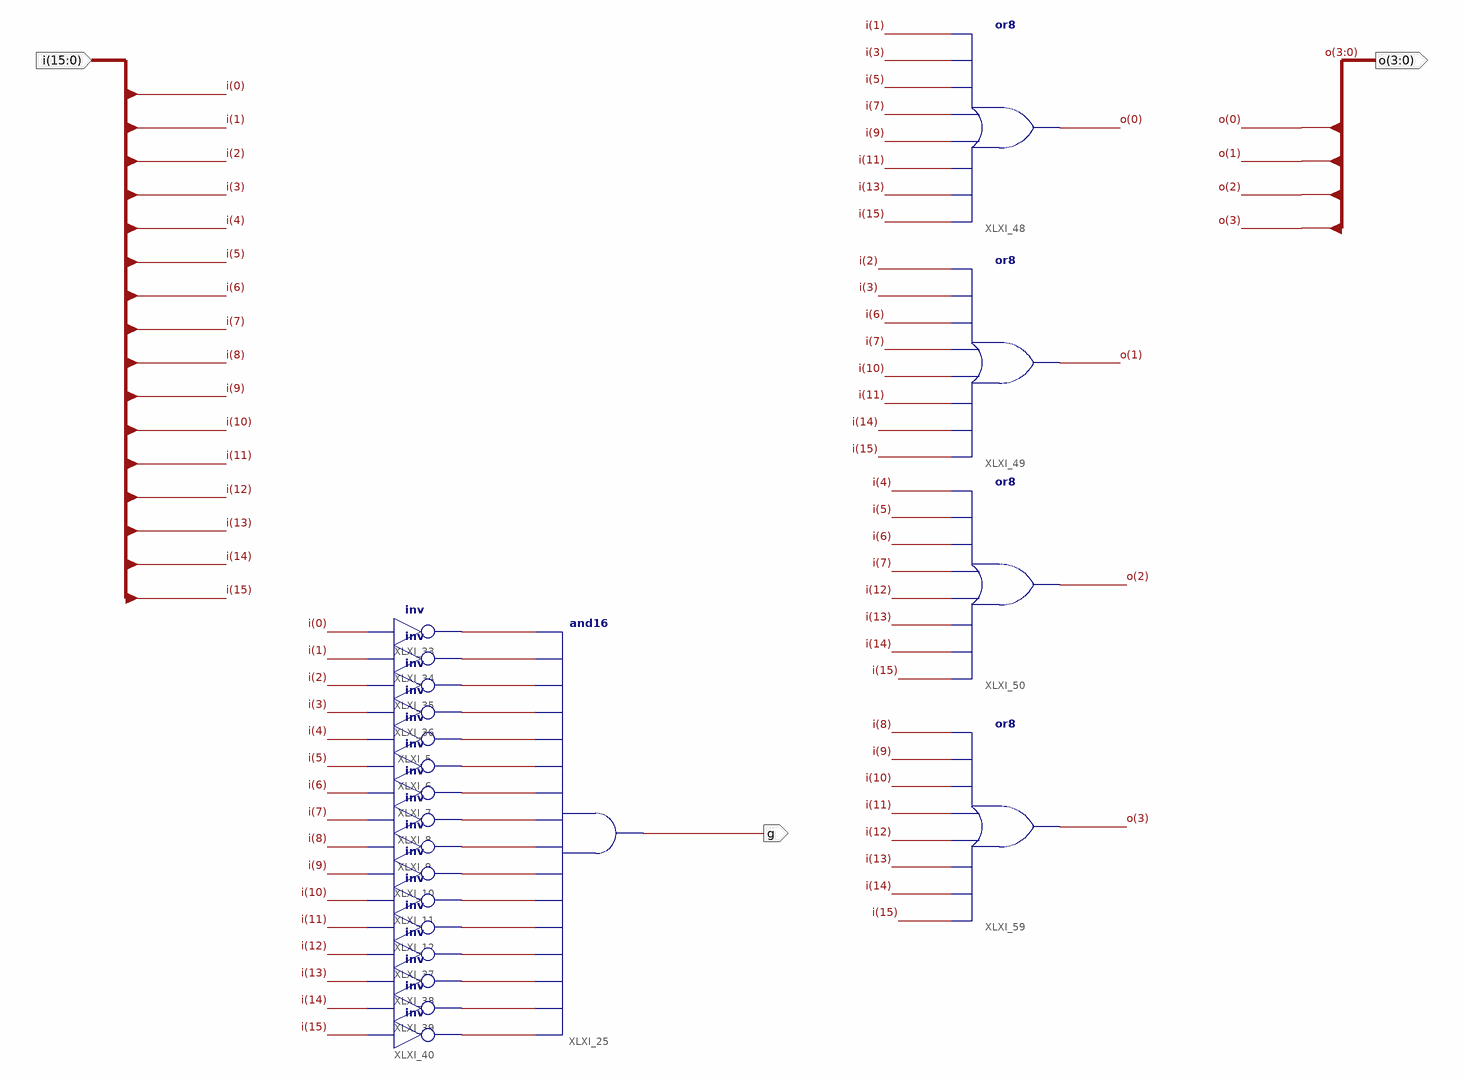
[diagram p0: schematic sheet 1]
// Xilinx ISE schematic encoder16_4.sch (aspartan6) as structural Verilog: 21 symbols, 3 ports
module encoder16_4 (
  input  [15:0] i,
  output g,
  output [3:0] o
);

  wire XLXN_1, XLXN_6, XLXN_19, XLXN_20, XLXN_21, XLXN_22, XLXN_24, XLXN_25, XLXN_83, XLXN_84, XLXN_85,
       XLXN_86, XLXN_91, XLXN_92, XLXN_93, XLXN_94;

  not XLXI_5 (XLXN_1, i[4]);
  not XLXI_6 (XLXN_19, i[5]);
  not XLXI_7 (XLXN_20, i[6]);
  not XLXI_8 (XLXN_21, i[7]);
  not XLXI_9 (XLXN_22, i[8]);
  not XLXI_10 (XLXN_6, i[9]);
  not XLXI_11 (XLXN_24, i[10]);
  not XLXI_12 (XLXN_25, i[11]);
  and XLXI_25 (g, XLXN_94, XLXN_93, XLXN_92, XLXN_91, XLXN_25, XLXN_24, XLXN_6, XLXN_22, XLXN_21, XLXN_20, XLXN_19, XLXN_1, XLXN_86, XLXN_85, XLXN_84, XLXN_83);
  not XLXI_33 (XLXN_83, i[0]);
  not XLXI_34 (XLXN_84, i[1]);
  not XLXI_35 (XLXN_85, i[2]);
  not XLXI_36 (XLXN_86, i[3]);
  not XLXI_37 (XLXN_91, i[12]);
  not XLXI_38 (XLXN_92, i[13]);
  not XLXI_39 (XLXN_93, i[14]);
  not XLXI_40 (XLXN_94, i[15]);
  or XLXI_48 (o[0], i[15], i[13], i[11], i[9], i[7], i[5], i[3], i[1]);
  or XLXI_49 (o[1], i[15], i[14], i[11], i[10], i[7], i[6], i[3], i[2]);
  or XLXI_50 (o[2], i[15], i[14], i[13], i[12], i[7], i[6], i[5], i[4]);
  or XLXI_59 (o[3], i[15], i[14], i[13], i[12], i[11], i[10], i[9], i[8]);
endmodule
